# Altium project Student_Board.PrjPcb
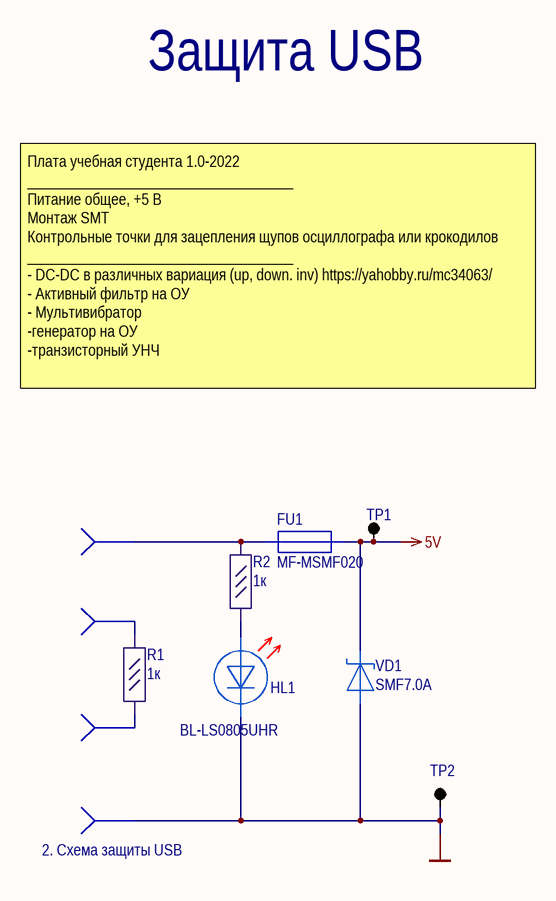
[diagram p0: USB_Protection.SchDoc]
6 sheets, 101 parts. Net scope: global (net labels, ports and power ports of the same name join across sheets).
Board file: PCB2.PcbDoc
Sheets:
  USB_Protection.SchDoc
  DC-DC.SchDoc
  Radio_bug.SchDoc
  Amplifier.SchDoc
  Operational_amplifier.SchDoc
  Multivibrator.SchDoc

## Sheet USB_Protection.SchDoc: Наименование
size 209 x 297 mm; ApprovedBy: Утвердил; CheckedBy: Проверил; Author: Разработал; CompanyName: Организация; DrawnBy: Н.Контр; Engineer: Т.Контр; SheetNumber: 1; SheetTotal: 6; PageSetup: Record=PageOptions|CenterHorizontal=True|CenterVertical=True|PrintScale=0.94|XCorrection=1.00|YCorrection=1.00|PrintKind=1|BorderSize=5000000|LeftOffset=0|BottomOffset=0|Orientation=1|PaperLength=1000|PaperWidth=1000|Scale=100|PaperSource=7|PrintQuality=-4|MediaType=1|DitherType=10|PaperKind=A4|PrintScaleMode=1; DecimalNumber: Децимальный номер; HeadOfSector: Нач. сектора; MainDevice: Перв.примен.; Name: Наименование; DocumentName: Sheet1.SCHDOC

### Parts
FU1  MF-MSMF020  [FUSE 1812]
HL1  BL-LS0805UHR  [LED_0805_RED]
R1  1к  [R_0805]
R2  1к  [R_0805]
TP1  Test_Point_1  [PLS-1]  (value not drawn)
TP2  Test_Point_1  [PLS-1]  (value not drawn)
VD1  SMF7.0A  [SOD-123F]
X1  X  [KT_1]  (value not drawn)
X2  X  [KT_1]  (value not drawn)
X3  X  [KT_1]  (value not drawn)
X4  X  [KT_1]  (value not drawn)

### Nets
5V: FU1.2 TP1.1 VD1.2
GND: HL1.2 TP2.1 VD1.1 X4.1
NetFU1_1: FU1.1 R2.1 X1.1
NetHL1_1: HL1.1 R2.2
NetR1_1: R1.1 X2.1
NetR1_2: R1.2 X3.1

### Notes on the sheet
- Защита USB
- Плата учебная студента 1.0-2022
  ___________________________________
  Питание общее, +5 В
  Монтаж SMT
  Контрольные точки для зацепления щупов осциллографа или крокодилов
  ___________________________________
  - DC-DC в различных вариация (up, down. inv) https://yahobby.ru/mc34063/
  - Активный фильтр на ОУ
  - Мультивибратор
  -генератор на ОУ
  -транзисторный УНЧ
- (near X4) 2. Схема защиты USB
- Перв.примен.
- Справ.№
- Подп. и дата
- Инв.№ дубл.
- Взам.инв.№
- Подп.и дата
- Разраб.
- Изм.
- Лист
- № докум.
- Подп.
- Дата
- Лит.
- Масштаб
- Масса
- Т.контр.
- Пров.
- ПРИНЦИПИАЛЬНАЯ
- СХЕМА   ЭЛЕКТРИЧЕСКАЯ
- Листов
- Инв.№ подл.
- Утв.
- Н.контр.
- Нач.сект.
- Копировал
- Формат  A3

### Library data of the parts
R1 R2 = CR0603-FX-1002ELF: RES SMD 10K OHM 1% 1/10W 0603; Manufacturer: Bourns Inc.; Value: 10 к; Part Number: CR0603-FX-1002ELF; ComponentLink1URL: https://www.bourns.com/pdfs/chpreztr.pdf; ComponentLink1Description: Datasheet; Component Type: Resistor
VD1 = SMAJ5.0A-TR: Защитный диод, однонаправленный
X1-X4 = X: Контактная площадка

## Sheet DC-DC.SchDoc: Наименование
size 209 x 297 mm; ApprovedBy: Утвердил; CheckedBy: Проверил; Author: Разработал; CompanyName: Организация; DrawnBy: Н.Контр; Engineer: Т.Контр; SheetNumber: 2; SheetTotal: 6; PageSetup: Record=PageOptions|CenterHorizontal=True|CenterVertical=True|PrintScale=0.94|XCorrection=1.00|YCorrection=1.00|PrintKind=1|BorderSize=5000000|LeftOffset=0|BottomOffset=0|Orientation=1|PaperLength=1000|PaperWidth=1000|Scale=100|PaperSource=7|PrintQuality=-4|MediaType=1|DitherType=10|PaperKind=A4|PrintScaleMode=1; DecimalNumber: Децимальный номер; HeadOfSector: Нач. сектора; MainDevice: Перв.примен.; Name: Наименование; DocumentName: Sheet1.SCHDOC
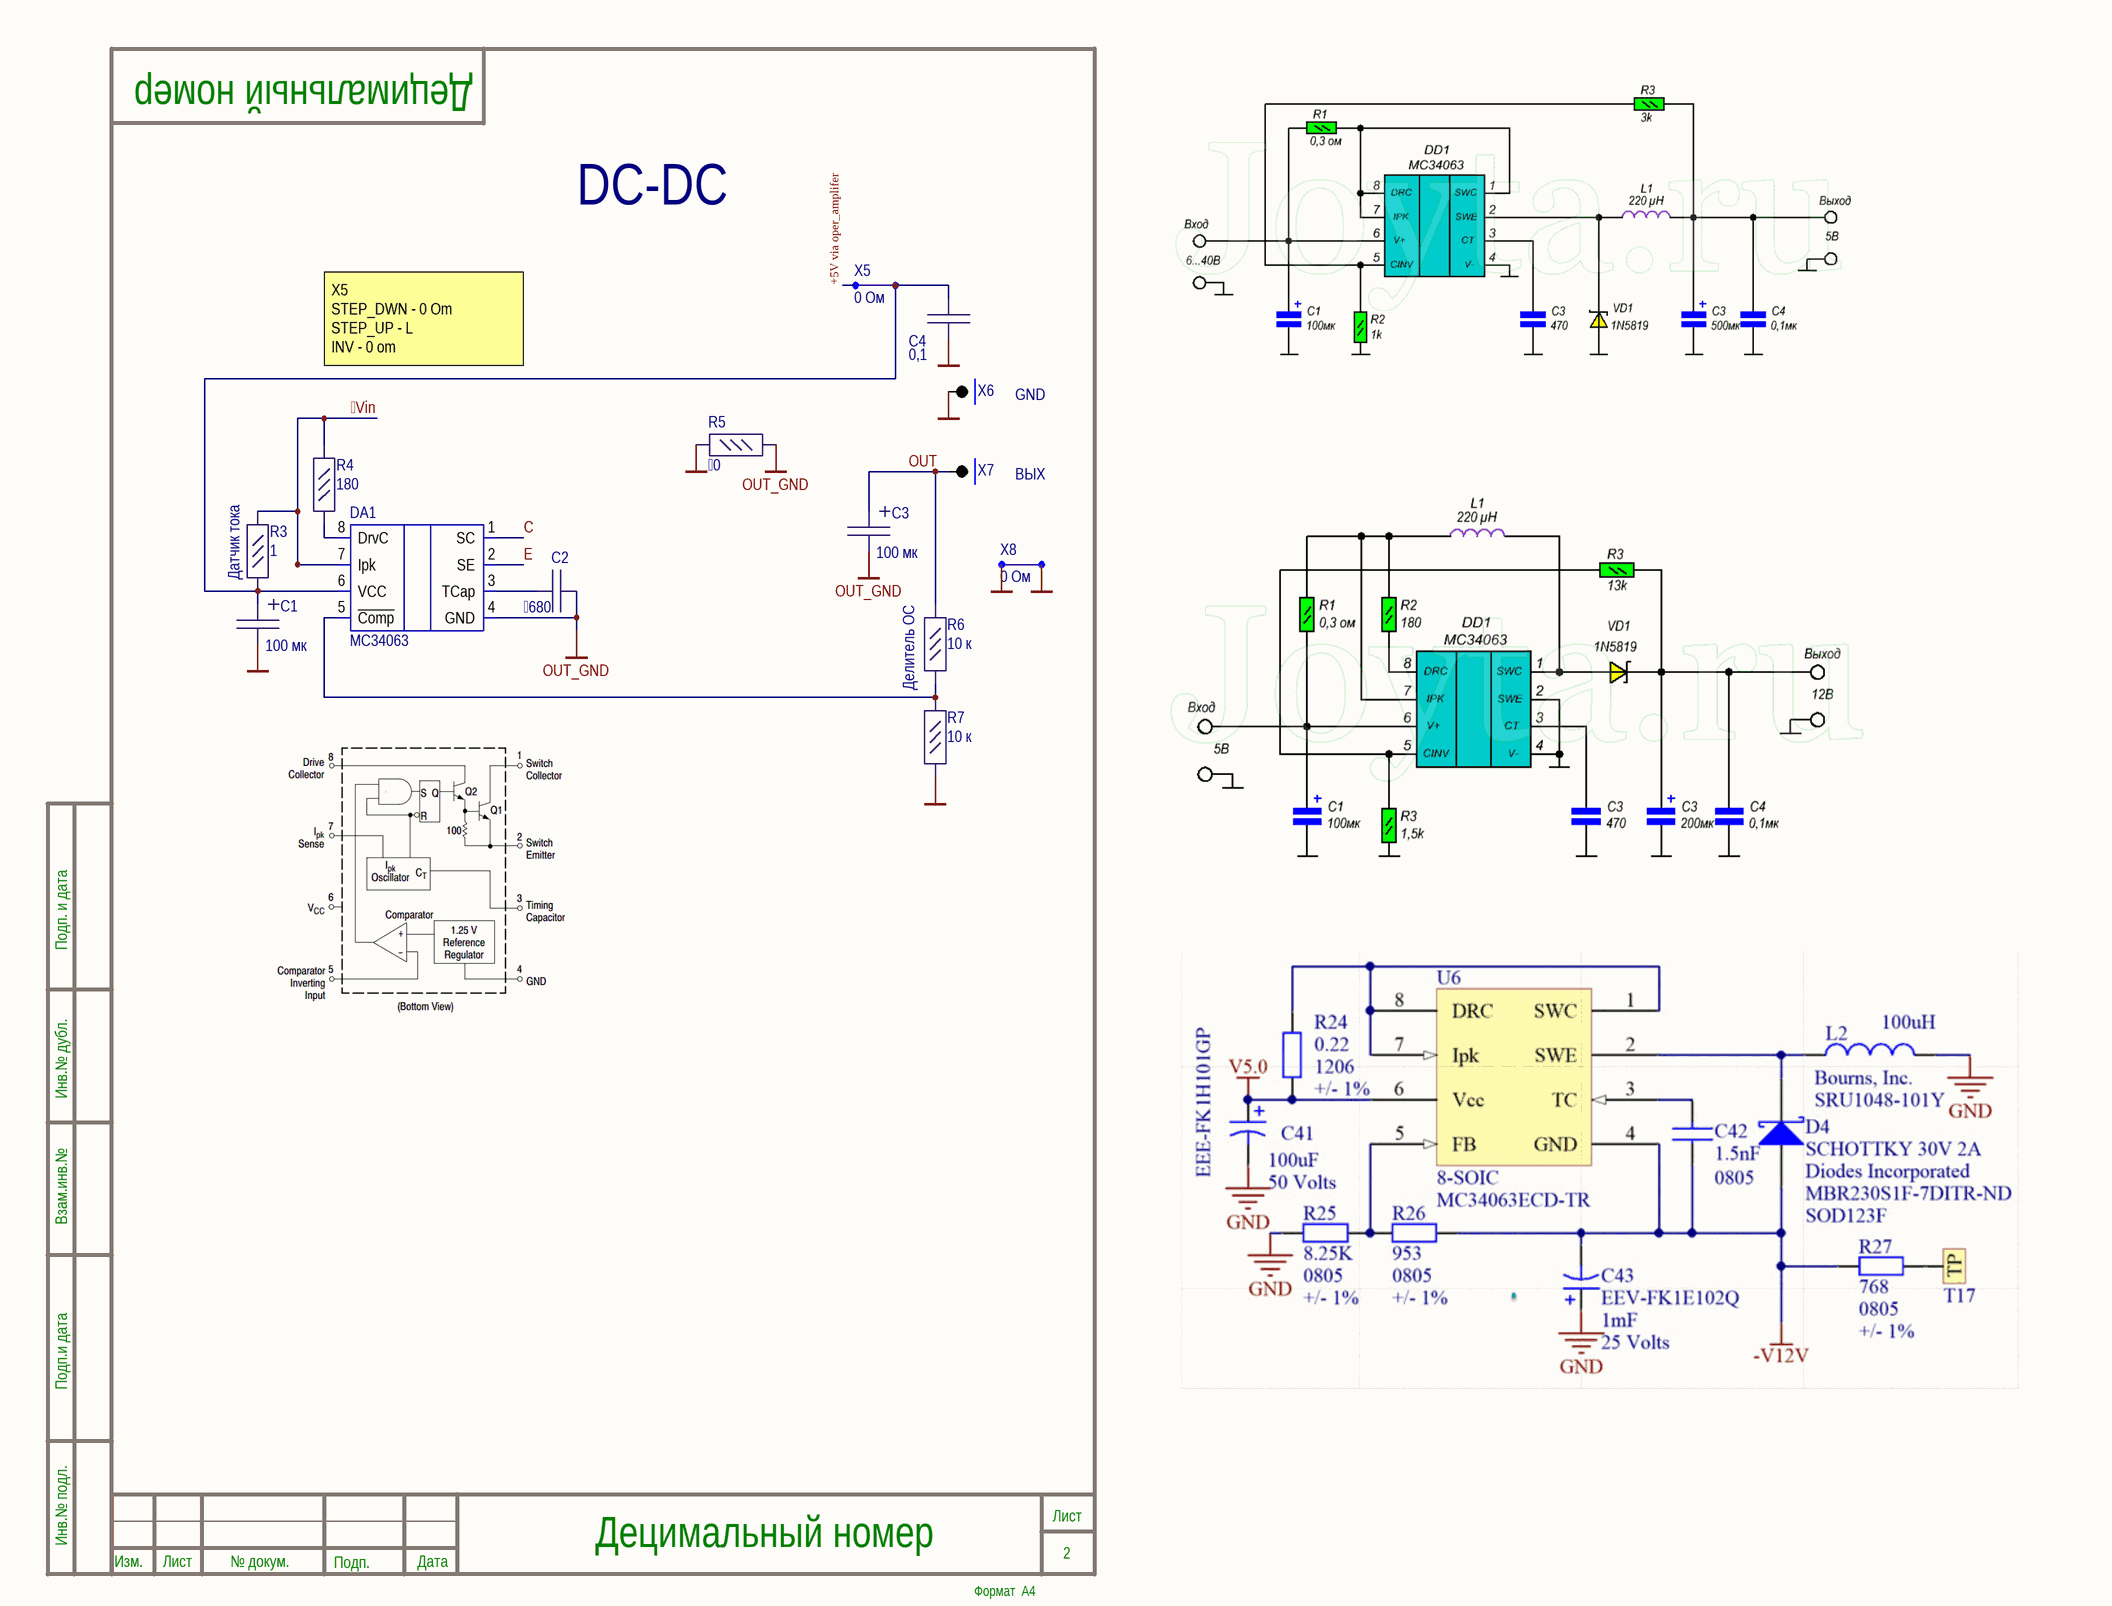
[diagram p1: DC-DC.SchDoc]

### Parts
C1  100 мк  [SMD_al_cap_0605_6.3]
C2  680  [C_0805]
C3  100 мк  [SMD_al_cap_0605_6.3]
C4  0,1  [C_0805]
DA1  MC34063  [SO-8]
R3  1  [R_0805]
R4  180  [R_0805]
R5  0  [R_0805]
R6  10 к  [R_0805]
R7  10 к  [R_0805]
X5  0 Ом  [jumper]
X6  КТ  [PLS-1]  (value not drawn)
X7  КТ  [PLS-1]  (value not drawn)
X8  0 Ом  [jumper]

### Nets
GND: C1.2 C4.2 R5.1 R7.2 X6.1 X8.1 X8.2
OUT_GND: C2.1 C3.2 DA1.4(GND) R5.2
Vin: DA1.7(Ipk) R3.1 R4.1
+5V via oper_amplifer: X5.1
C: DA1.1(SC)
E: DA1.2(SE)
OUT: C3.1 R6.1 X7.1
NetC1_1: C1.1 C4.1 DA1.6(VCC) R3.2 X5.2
NetC2_2: C2.2 DA1.3(TCap)
NetDA1_5: DA1.5(~{Comp}) R6.2 R7.1
NetDA1_8: DA1.8(DrvC) R4.2

### Notes on the sheet
- DC-DC
- X5
  STEP_DWN - 0 Om
  STEP_UP - L
  INV - 0 om
- (near X6) GND
- ВЫХ
- (near R3) Датчик тока
- Делитель ОС
- Подп. и дата
- Инв.№ дубл.
- Взам.инв.№
- Подп.и дата
- Инв.№ подл.
- Изм.
- Лист
- № докум.
- Подп.
- Дата
- Формат  A4

### Library data of the parts
C1 C3 = TAJB107K004RNJ: CAP TANT 100UF 10% 4V 1411; Manufacturer: AVX Corporation; Value: 100µF; Part Number: TAJB107K004RNJ; ComponentLink1URL: http://datasheets.avx.com/TAJ.pdf; ComponentLink1Description: Datasheet; Component Type: Tantalum Capacitor
C2 C4 = GRM188R72A104KA35D: CAP CER 0.1UF 100V X7R 0603; Manufacturer: Murata Electronics; Value: 0.1µF; Part Number: GRM188R72A104KA35D; ComponentLink1URL: https://www.murata.com/~/media/webrenewal/support/library/catalog/products/capacitor/mlcc/c02e.ashx?la=en-us; ComponentLink1Description: Datasheet; Component Type: Capasitor
R3-R5 = CR0603-FX-1002ELF: as R1 on sheet USB_Protection; Part Number: CR0603-FX-1002ELF; ComponentLink1URL: https://www.bourns.com/pdfs/chpreztr.pdf; ComponentLink1Description: Datasheet; Component Type: Resistor
R6 R7 = CR0603-FX-1002ELF: RES SMD 10K OHM 1% 1/10W 0603; Manufacturer: Bourns Inc.; Part Number: CR0603-FX-1002ELF; Value: 10 к; ComponentLink1URL: https://www.bourns.com/pdfs/chpreztr.pdf; ComponentLink1Description: Datasheet; Component Type: Resistor
X5 X8 = 0 Ohm (0805)

## Sheet Radio_bug.SchDoc: Наименование
size 209 x 297 mm; ApprovedBy: Утвердил; CheckedBy: Проверил; Author: Разработал; CompanyName: Организация; DrawnBy: Н.Контр; Engineer: Т.Контр; SheetNumber: 3; SheetTotal: 6; PageSetup: Record=PageOptions|CenterHorizontal=True|CenterVertical=True|PrintScale=0.94|XCorrection=1.00|YCorrection=1.00|PrintKind=1|BorderSize=5000000|LeftOffset=0|BottomOffset=0|Orientation=1|PaperLength=1000|PaperWidth=1000|Scale=100|PaperSource=7|PrintQuality=-4|MediaType=1|DitherType=10|PaperKind=A4|PrintScaleMode=1; DecimalNumber: Децимальный номер; HeadOfSector: Нач. сектора; MainDevice: Перв.примен.; Name: Наименование; DocumentName: Sheet1.SCHDOC
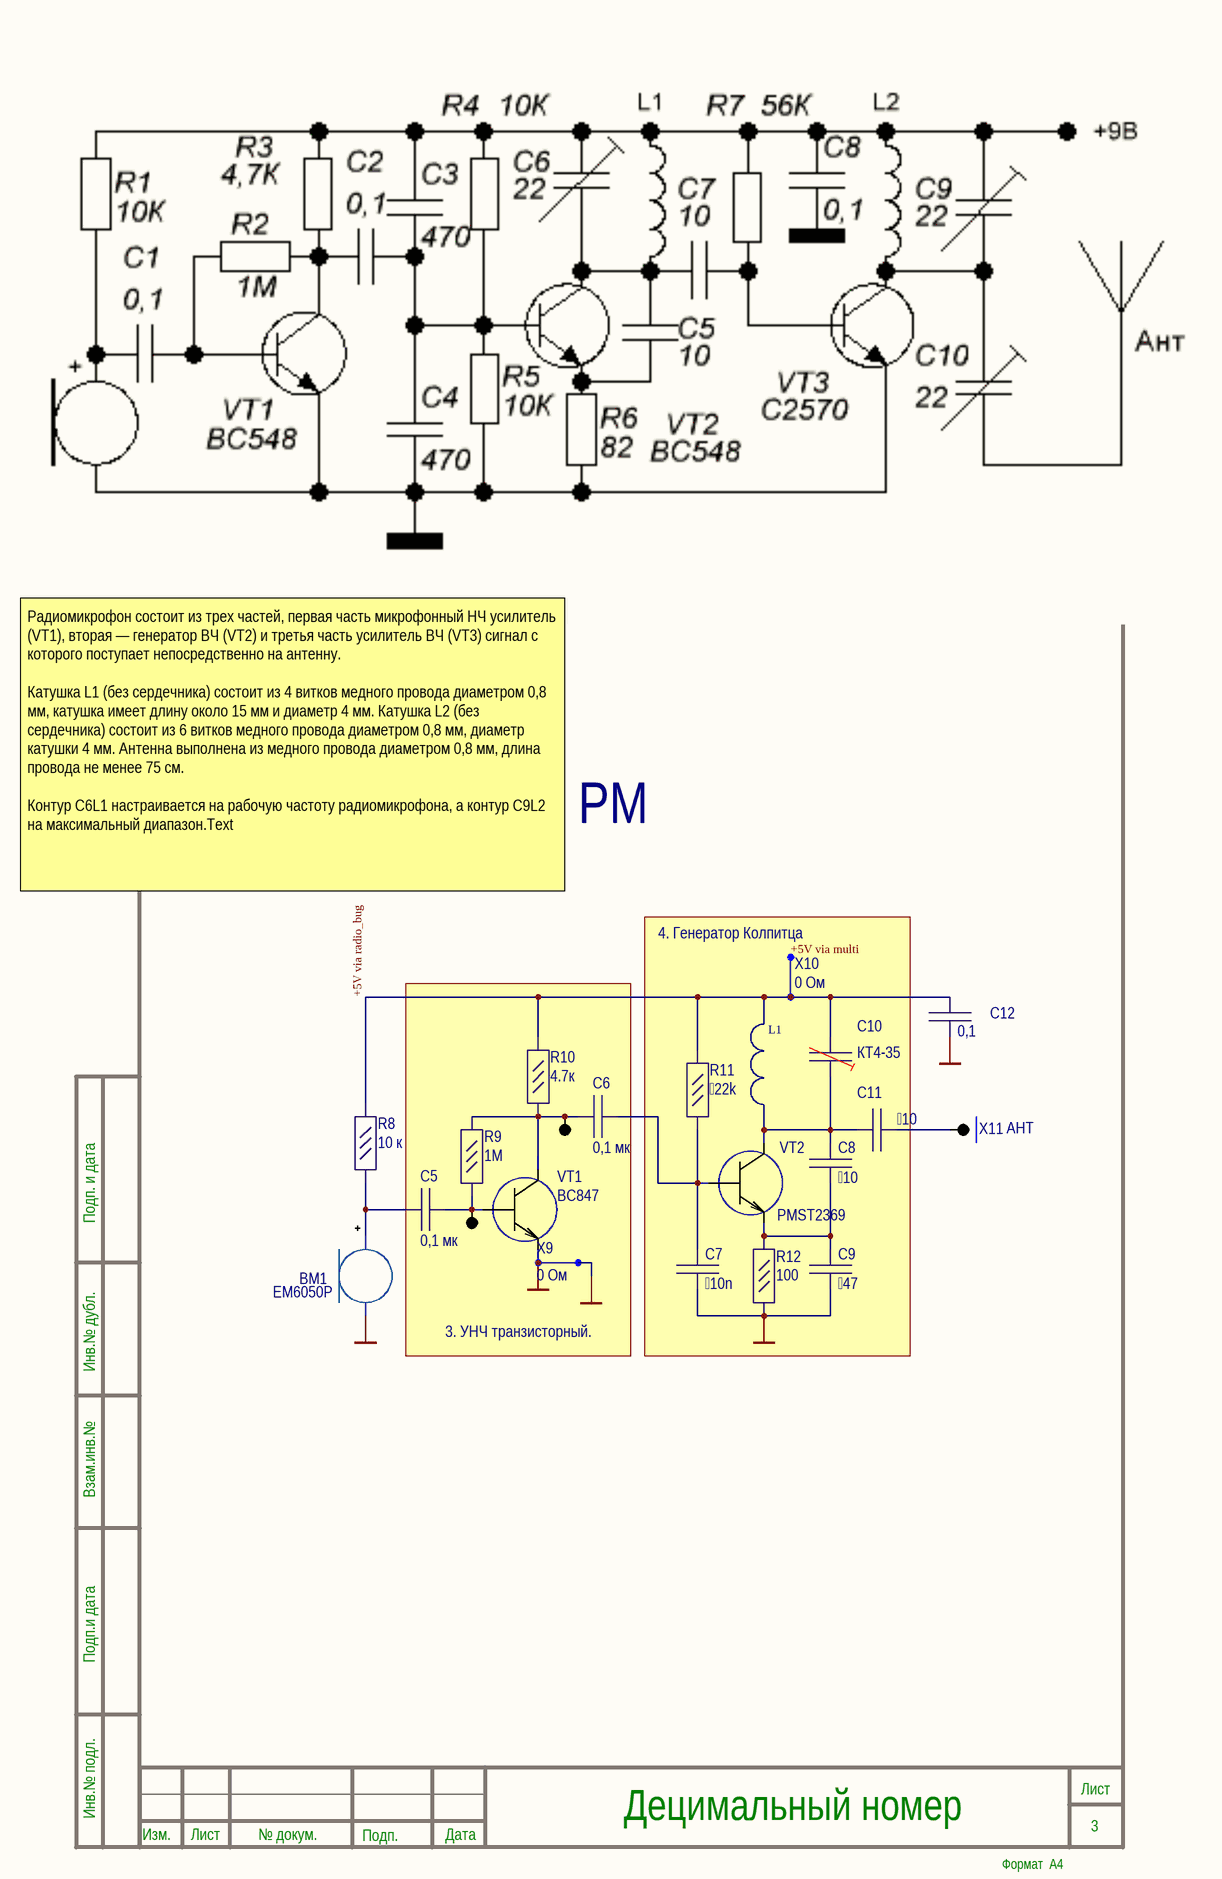
[diagram p2: Radio_bug.SchDoc]

### Parts
(Parts that share a designator on the sheet are numbered #1, #2 ... from top to bottom, then left to right.)
BM1  EM6050P  [EM6050P]
C5  0,1 мк  [C_0805]
C6  0,1 мк  [C_0805]
C7  10n  [C_0805]
C8  10  [C_0805]
C9  47  [C_0805]
C10  КТ4-35  [KТ4-35]
C11  10  [C_0805]
C12  0,1  [C_0805]
L1  Inductor  [Inductor]  (value not drawn)
R8  10 к  [R_0805]
R9  1М  [R_0805]
R10  4.7к  [R_0805]
R11  22k  [R_0805]
R12#1  100  [R_0805]
TP3  Test_Point_1  [PLS-1]  (value not drawn)
TP4  Test_Point_1  [PLS-1]  (value not drawn)
VT1  BC847  [SOT23]
VT2  PMST2369  [SOT-323]
X9  0 Ом  [jumper]
X10  0 Ом  [jumper]
X11  КТ  [PLS-1]  (value not drawn)

### Blocks framed on the sheet
4. Генератор Колпитца: C7-C11 L1 R11 R12#1 VT2 X10
3. УНЧ транзисторный.: C5 C6 R9 R10 TP3 TP4 VT1 X9

### Nets
GND: BM1.2 C7.2 C9.2 C12.2 R12#1.2 VT1.2(E) X9.1 X9.2
+5V via multi: X10.2
+5V via radio_bug: C10.1 C12.1 L1.2 R8.1 R10.1 R11.1 X10.1
NetBM1_1: BM1.1 C5.1 R8.2
NetC5_2: C5.2 R9.2 TP3.1 VT1.1(B)
NetC6_1: C6.1 R9.1 R10.2 TP4.1 VT1.3(C)
NetC6_2: C6.2 C7.1 R11.2 VT2.1(B)
NetC8_1: C8.1 C10.2 C11.2 L1.1 VT2.3(C)
NetC8_2: C8.2 C9.1 R12#1.1 VT2.2(E)
NetC11_1: C11.1 X11.1

### Notes on the sheet
- Радиомикрофон состоит из трех частей, первая часть микрофонный НЧ усилитель (VT1), вторая — генератор ВЧ (VT2) и третья часть усилитель ВЧ (VT3) сигнал с которого поступает непосредственно на антенну.
  Катушка L1 (без сердечника) состоит из 4 витков медного провода диаметром 0,8 мм, катушка имеет длину около 15 мм и диаметр 4 мм. Катушка L2 (без сердечника) состоит из 6 витков медного провода диаметром 0,8 мм, диаметр катушки 4 мм. Антенна выполнена из медного провода диаметром 0,8 мм, длина провода не менее 75 см.
  Контур С6L1 настраивается на рабочую частоту радиомикрофона, а контур С9L2 на максимальный диапазон.Text
- PM
- (near X11) АНТ
- Подп. и дата
- Инв.№ дубл.
- Взам.инв.№
- Подп.и дата
- Инв.№ подл.
- Изм.
- Лист
- № докум.
- Подп.
- Дата
- Формат  A4

### Library data of the parts
C5-C9 C11 C12 = GRM188R72A104KA35D: as C2 on sheet DC-DC; Part Number: GRM188R72A104KA35D; ComponentLink1URL: https://www.murata.com/~/media/webrenewal/support/library/catalog/products/capacitor/mlcc/c02e.ashx?la=en-us; ComponentLink1Description: Datasheet; Component Type: Capasitor
R8 = CR0603-FX-1002ELF: as R6 on sheet DC-DC; Part Number: CR0603-FX-1002ELF; Value: 10 к; ComponentLink1URL: https://www.bourns.com/pdfs/chpreztr.pdf; ComponentLink1Description: Datasheet; Component Type: Resistor
R9-R11 R12#1 = CR0603-FX-1002ELF: as R1 on sheet USB_Protection; Part Number: CR0603-FX-1002ELF; ComponentLink1URL: https://www.bourns.com/pdfs/chpreztr.pdf; ComponentLink1Description: Datasheet; Component Type: Resistor
VT2 = BC847
X9 X10 = 0 Ohm (0805)

## Sheet Amplifier.SchDoc: Наименование
size 209 x 297 mm; ApprovedBy: Утвердил; CheckedBy: Проверил; Author: Разработал; CompanyName: Организация; DrawnBy: Н.Контр; Engineer: Т.Контр; SheetNumber: 4; SheetTotal: 6; PageSetup: Record=PageOptions|CenterHorizontal=True|CenterVertical=True|PrintScale=0.94|XCorrection=1.00|YCorrection=1.00|PrintKind=1|BorderSize=5000000|LeftOffset=0|BottomOffset=0|Orientation=1|PaperLength=1000|PaperWidth=1000|Scale=100|PaperSource=7|PrintQuality=-4|MediaType=1|DitherType=10|PaperKind=A4|PrintScaleMode=1; DecimalNumber: Децимальный номер; HeadOfSector: Нач. сектора; MainDevice: Перв.примен.; Name: Наименование; DocumentName: Sheet1.SCHDOC
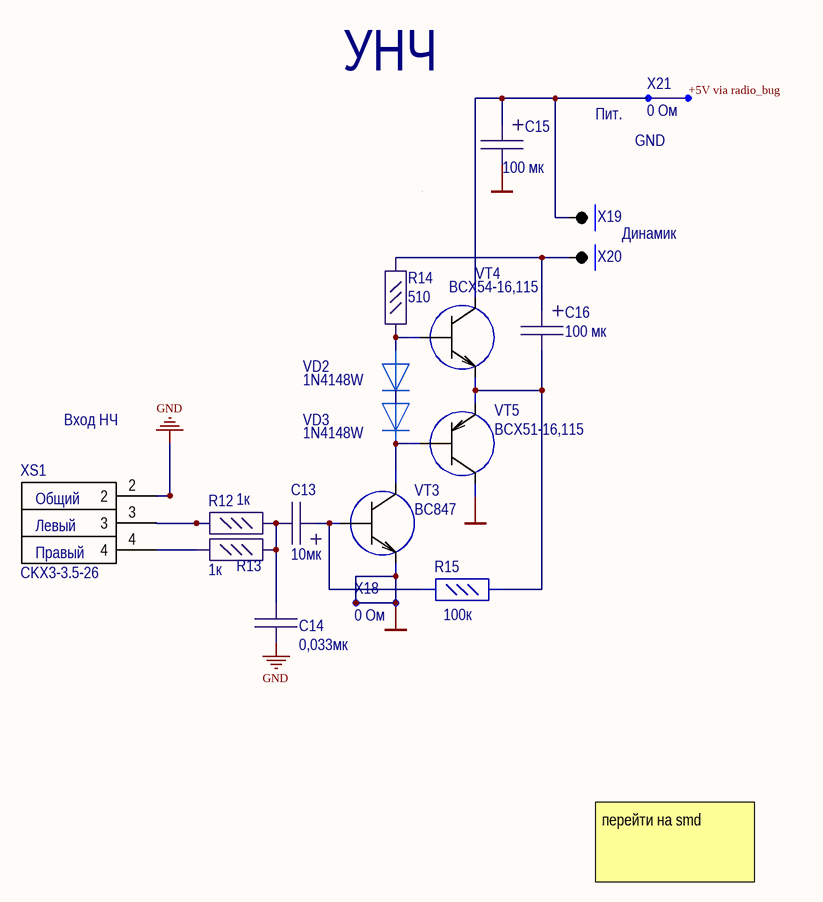
[diagram p3: Amplifier.SchDoc]

### Parts
(Parts that share a designator on the sheet are numbered #1, #2 ... from top to bottom, then left to right.)
C13  10мк  [C_CASE]
C14  0,033мк  [C_0805]
C15  100 мк  [SMD_al_cap_0605_6.3]
C16  100 мк  [C_CASE]
R12#2  1к  [R_0805]
R13  1к  [R_0805]
R14  510  [R_0805]
R15  100к  [R_0805]
VD2  1N4148W  [SOD-80]
VD3  1N4148W  [SOD-80]
VT3  BC847  [SOT23]
VT4  BCX54-16,115  [SOT89]
VT5  BCX51-16,115  [SOT89]
X18#1  0 Ом  [PLS-2]
X19#1  КТ  [PLS-1]  (value not drawn)
X20#1  КТ  [PLS-1]  (value not drawn)
X21#1  0 Ом  [PLS-2]
XS1  CKX3-3.5-26  [CKX3-3.5-26]

### Nets
GND: C14.1 C15.2 VT3.2(E) VT5.2(C) X18#1.1 X18#1.2 XS1.2
+5V via radio_bug: X21#1.2
NetC13_1: C13.1 R15.2 VT3.1(B)
NetC13_2: C13.2 C14.2 R12#2.2 R13.2
NetC15_1: C15.1 VT4.2(C) X19#1.1 X21#1.1
NetC16_1: C16.1 R14.2 X20#1.1
NetC16_2: C16.2 R15.1 VT4.3(E) VT5.3(E)
NetR12#2_1: R12#2.1 XS1.3
NetR13_1: R13.1 XS1.4
NetR14_1: R14.1 VD2.1 VT4.1(B)
NetVD2_2: VD2.2 VD3.1
NetVD3_2: VD3.2 VT3.3(C) VT5.1(B)

### Notes on the sheet
- УНЧ
- (near X21#1) Пит.
- (near X21#1) GND
- Динамик
- Вход НЧ
- перейти на smd
- Подп. и дата
- Инв.№ дубл.
- Взам.инв.№
- Подп.и дата
- Инв.№ подл.
- Изм.
- Лист
- № докум.
- Подп.
- Дата
- Формат  A4
- (in symbol CKX3-3.5-26) Общий; Левый; Правый

### Library data of the parts
C13 C15 C16 = TAJB107K004RNJ: as C1 on sheet DC-DC; Part Number: TAJB107K004RNJ; ComponentLink1URL: http://datasheets.avx.com/TAJ.pdf; ComponentLink1Description: Datasheet; Component Type: Tantalum Capacitor
C14 = GRM188R72A104KA35D: Manufacturer: Murata Electronics; Value: 0.1µF; Part Number: GRM188R72A104KA35D; ComponentLink1URL: https://www.murata.com/~/media/webrenewal/support/library/catalog/products/capacitor/mlcc/c02e.ashx?la=en-us; ComponentLink1Description: Datasheet; Component Type: Capasitor
R12#2 R13 = CR0603-FX-1002ELF: as R1 on sheet USB_Protection; Part Number: CR0603-FX-1002ELF; ComponentLink1URL: https://www.bourns.com/pdfs/chpreztr.pdf; ComponentLink1Description: Datasheet; Component Type: Resistor
R14 = CR0603-FX-1002ELF: Manufacturer: Bourns Inc.; Value: 10 к; Part Number: CR0603-FX-1002ELF; ComponentLink1URL: https://www.bourns.com/pdfs/chpreztr.pdf; ComponentLink1Description: Datasheet; Component Type: Resistor
R15 = R_C1-4
VD2 VD3 = LL4148-GS08: Диод
VT5 = BCX51-16,115_1
X18#1 X21#1 = 0 Ohm (0805)

## Sheet Operational_amplifier.SchDoc: Наименование
size 209 x 297 mm; ApprovedBy: Утвердил; CheckedBy: Проверил; Author: Разработал; CompanyName: Организация; DrawnBy: Н.Контр; Engineer: Т.Контр; SheetNumber: 5; SheetTotal: 6; PageSetup: Record=PageOptions|CenterHorizontal=True|CenterVertical=True|PrintScale=0.94|XCorrection=1.00|YCorrection=1.00|PrintKind=1|BorderSize=5000000|LeftOffset=0|BottomOffset=0|Orientation=1|PaperLength=1000|PaperWidth=1000|Scale=100|PaperSource=7|PrintQuality=-4|MediaType=1|DitherType=10|PaperKind=A4|PrintScaleMode=1; DecimalNumber: Децимальный номер; HeadOfSector: Нач. сектора; MainDevice: Перв.примен.; Name: Наименование; DocumentName: Sheet1.SCHDOC
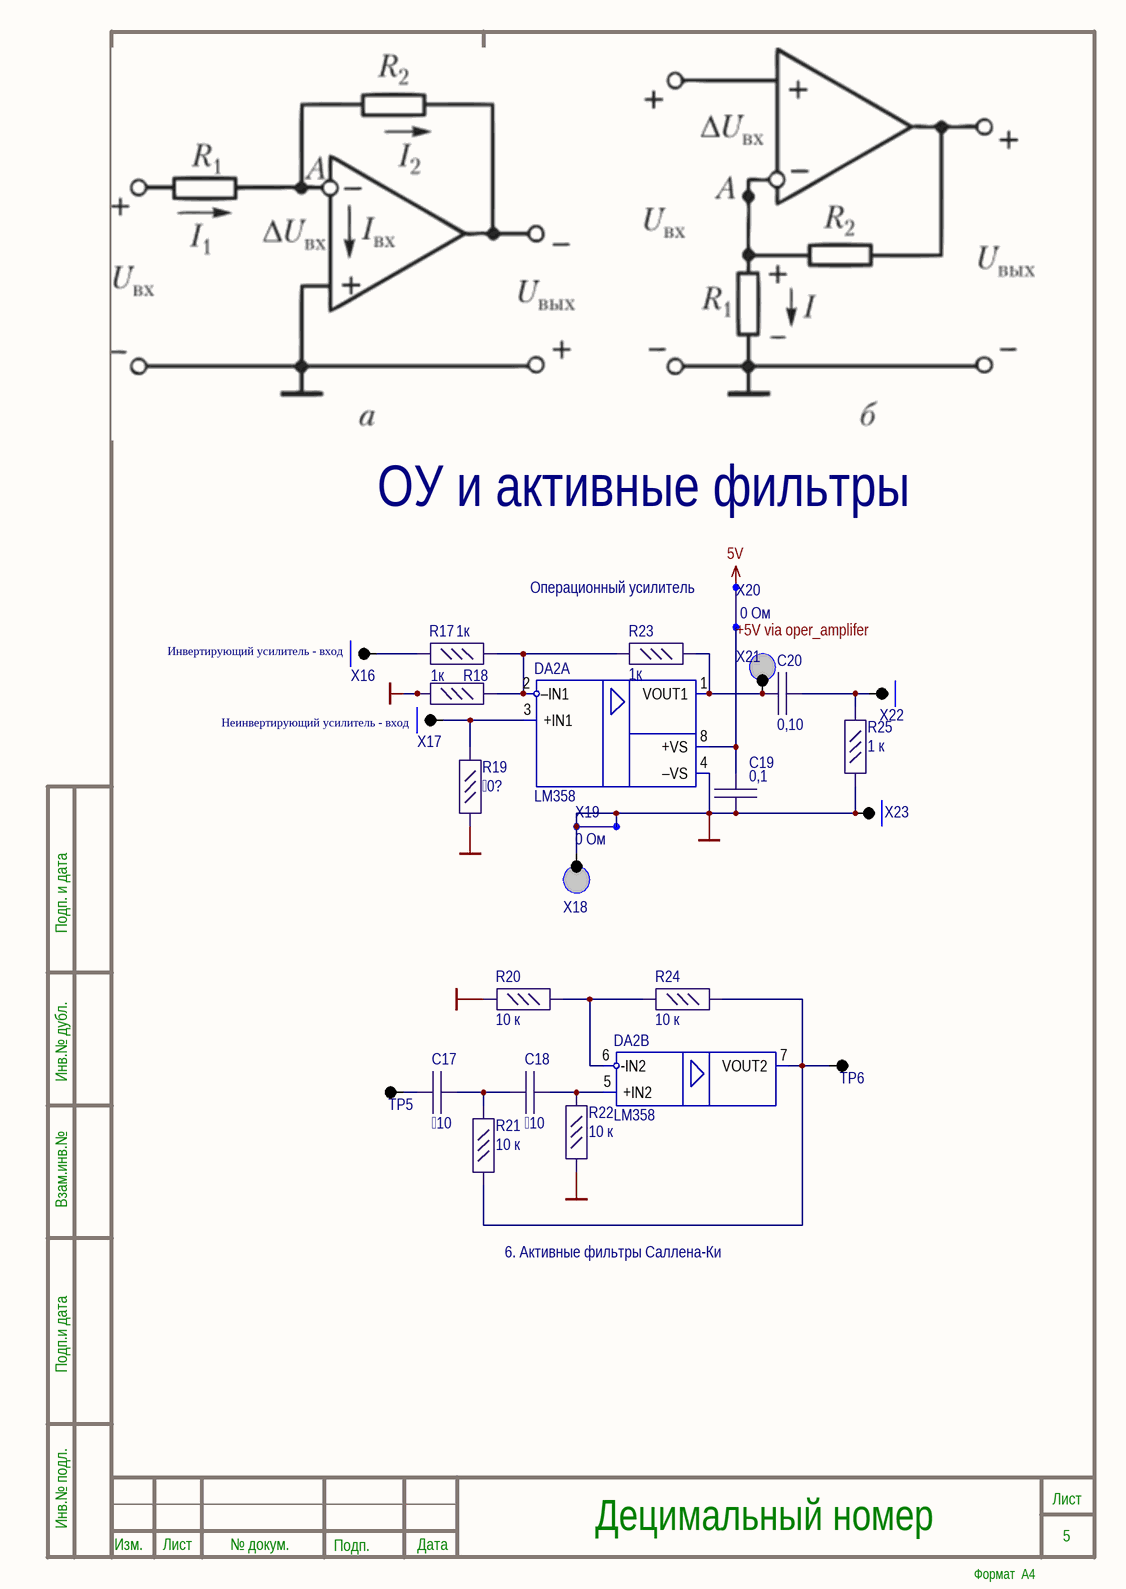
[diagram p4: Operational_amplifier.SchDoc]

### Parts
(Parts that share a designator on the sheet are numbered #1, #2 ... from top to bottom, then left to right.)
C17  10  [C_0805]
C18  10  [C_0805]
C19  0,1  [C_0805]
C20  0,10  [C_0805]
DA2  LM358  [SO-8]  (parts A,B of 2)
R17  1к  [R_0805]
R18  1к  [R_0805]
R19  0?  [R_0805]
R20  10 к  [R_0805]
R21  10 к  [R_0805]
R22  10 к  [R_0805]
R23  1к  [R_0805]
R24  10 к  [R_0805]
R25  1 к  [R_0805]
TP5  Test_Point_1  [PLS-1]  (value not drawn)
TP6  Test_Point_1  [PLS-1]  (value not drawn)
X16  КТ  [PLS-1]  (value not drawn)
X17  КТ  [PLS-1]  (value not drawn)
X18#2  КТ  [PLS-1]  (value not drawn)
X19#2  0 Ом  [jumper]
X20#2  0 Ом  [jumper]
X21#2  КТ  [PLS-1]  (value not drawn)
X22  КТ  [PLS-1]  (value not drawn)
X23  КТ  [PLS-1]  (value not drawn)

### Nets
5V: X20#2.2
GND: C19.2 DA2.4(–VS) R18.2 R19.2 R20.2 R22.2 R25.2 X18#2.1 X19#2.1 X19#2.2 X23.1
+5V via oper_amplifer: C19.1 DA2.8(+VS) X20#2.1
NetC17_1: C17.1 TP5.1
NetC17_2: C17.2 C18.1 R21.1
NetC18_2: C18.2 DA2.5(+IN2) R22.1
NetC20_1: C20.1 DA2.1(VOUT1) R23.1 X21#2.1
NetC20_2: C20.2 R25.1 X22.1
NetDA2_2: DA2.2(–IN1) R17.1 R18.1 R23.2
NetDA2_3: DA2.3(+IN1) R19.1 X17.1
NetDA2_6: DA2.6(-IN2) R20.1 R24.2
NetDA2_7: DA2.7(VOUT2) R21.2 R24.1 TP6.1
NetR17_2: R17.2 X16.1

### Notes on the sheet
- ОУ и активные фильтры
- Операционный усилитель
- (near X16) Инвертирующий усилитель - вход
- (near X17) Неинвертирующий усилитель - вход
- 6. Активные фильтры Саллена-Ки
- Подп. и дата
- Инв.№ дубл.
- Взам.инв.№
- Подп.и дата
- Инв.№ подл.
- Изм.
- Лист
- № докум.
- Подп.
- Дата
- Формат  A4

### Library data of the parts
C17-C20 = GRM188R72A104KA35D: as C2 on sheet DC-DC; Part Number: GRM188R72A104KA35D; ComponentLink1URL: https://www.murata.com/~/media/webrenewal/support/library/catalog/products/capacitor/mlcc/c02e.ashx?la=en-us; ComponentLink1Description: Datasheet; Component Type: Capasitor
R17-R19 R23 R25 = CR0603-FX-1002ELF: as R1 on sheet USB_Protection; Part Number: CR0603-FX-1002ELF; ComponentLink1URL: https://www.bourns.com/pdfs/chpreztr.pdf; ComponentLink1Description: Datasheet; Component Type: Resistor
R20-R22 R24 = CR0603-FX-1002ELF: as R6 on sheet DC-DC; Part Number: CR0603-FX-1002ELF; Value: 10 к; ComponentLink1URL: https://www.bourns.com/pdfs/chpreztr.pdf; ComponentLink1Description: Datasheet; Component Type: Resistor
X19#2 X20#2 = 0 Ohm (0805)

## Sheet Multivibrator.SchDoc: Наименование
size 209 x 297 mm; ApprovedBy: Утвердил; CheckedBy: Проверил; Author: Разработал; CompanyName: Организация; DrawnBy: Н.Контр; Engineer: Т.Контр; SheetNumber: 6; SheetTotal: 6; PageSetup: Record=PageOptions|CenterHorizontal=True|CenterVertical=True|PrintScale=0.94|XCorrection=1.00|YCorrection=1.00|PrintKind=1|BorderSize=5000000|LeftOffset=0|BottomOffset=0|Orientation=1|PaperLength=1000|PaperWidth=1000|Scale=100|PaperSource=7|PrintQuality=-4|MediaType=1|DitherType=10|PaperKind=A4|PrintScaleMode=1; DecimalNumber: Децимальный номер; HeadOfSector: Нач. сектора; MainDevice: Перв.примен.; Name: Наименование; DocumentName: Sheet1.SCHDOC
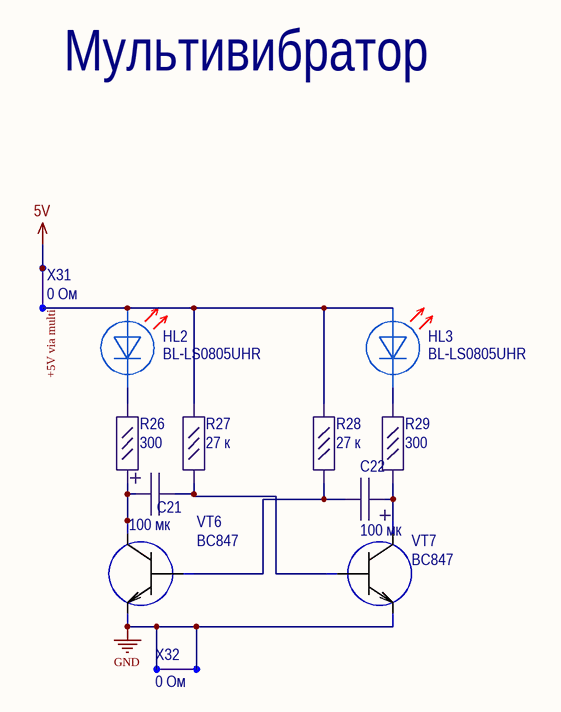
[diagram p5: Multivibrator.SchDoc]

### Parts
C21  100 мк  [SMD_al_cap_0605_6.3]
C22  100 мк  [SMD_al_cap_0605_6.3]
HL2  BL-LS0805UHR  [LED_0805_RED]
HL3  BL-LS0805UHR  [LED_0805_RED]
R26  300  [R_0805]
R27  27 к  [R_0805]
R28  27 к  [R_0805]
R29  300  [R_0805]
VT6  BC847  [SOT23]
VT7  BC847  [SOT23]
X31  0 Ом  [PLS-2]
X32  0 Ом  [PLS-2]

### Nets
5V: X31.2
GND: VT6.2(E) VT7.2(E) X32.1 X32.2
+5V via multi: HL2.1 HL3.1 R27.1 R28.1 X31.1
NetC21_1: C21.1 R26.2 VT6.3(C)
NetC21_2: C21.2 R27.2 VT7.1(B)
NetC22_1: C22.1 R29.2 VT7.3(C)
NetC22_2: C22.2 R28.2 VT6.1(B)
NetHL2_2: HL2.2 R26.1
NetHL3_2: HL3.2 R29.1

### Notes on the sheet
- Мультивибратор
- Подп. и дата
- Инв.№ дубл.
- Взам.инв.№
- Подп.и дата
- Инв.№ подл.
- Изм.
- Лист
- № докум.
- Подп.
- Дата
- Формат  A4

### Library data of the parts
C21 C22 = TAJB107K004RNJ: as C1 on sheet DC-DC; Part Number: TAJB107K004RNJ; ComponentLink1URL: http://datasheets.avx.com/TAJ.pdf; ComponentLink1Description: Datasheet; Component Type: Tantalum Capacitor
R26-R29 = CR0603-FX-1002ELF: as R1 on sheet USB_Protection; Part Number: CR0603-FX-1002ELF; ComponentLink1URL: https://www.bourns.com/pdfs/chpreztr.pdf; ComponentLink1Description: Datasheet; Component Type: Resistor
X31 X32 = 0 Ohm (0805)

## Nets that join several sheets
5V: USB_Protection (FU1.2 TP1.1 VD1.2), Operational_amplifier (X20#2.2), Multivibrator (X31.2)
GND: USB_Protection (HL1.2 TP2.1 VD1.1 X4.1), DC-DC (7 pins), Radio_bug (8 pins), Amplifier (7 pins), Operational_amplifier (11 pins), Multivibrator (VT6.2 VT7.2 X32.1 X32.2)
+5V via multi: Radio_bug (X10.2), Multivibrator (5 pins)
+5V via oper_amplifer: DC-DC (X5.1), Operational_amplifier (C19.1 DA2.8 X20#2.1)
+5V via radio_bug: Radio_bug (7 pins), Amplifier (X21#1.2)